# Altium schematic sheet 其他模块2.SchDoc
size A4
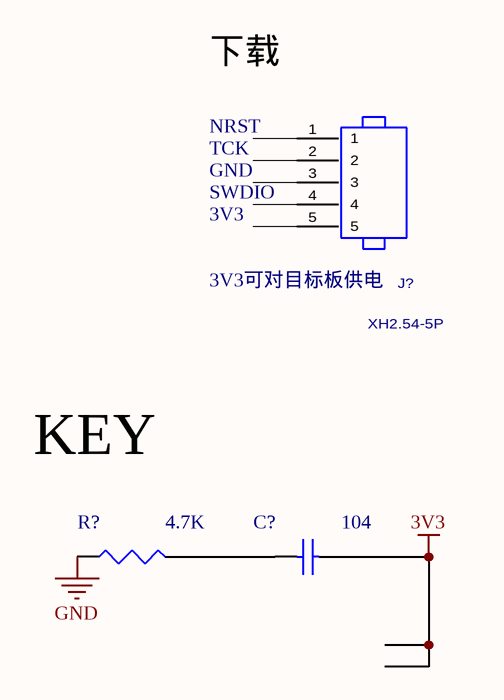
[diagram p0: 其他模块2.SchDoc]

## Parts
C?  value 104  [RAD-0.3]  (hidden comment: Cap)
J?  XH2.54-5P  [XH2.54-5P]
R?  value 4.7K  [J1-0603]  (hidden comment: Res3)

## Nets
3V3: C?.2
GND: R?.1
NetC?_1: C?.1 R?.2

Not connected (* = marked no-connect by the designer): J? 1 2 3 4 5

## Notes on the sheet
- NRST
- 下载
- TCK
- (near J?) SWDIO
- GND
- 3V3
- (near J?) 3V3可对目标板供电
- KEY

## Library data of the parts
C? = Cap: Capacitor; Published: 8-Jun-2000; LatestRevisionDate: 17-Jul-2002; LatestRevisionNote: Re-released for DXP Platform.; PackageReference: RAD-0.3; Publisher: Altium Limited; PackageDescription: Radial Cap, Thru-Hole; 2 Leads; 0.3 in Pin Spacing
R? = Res3: Resistor; Published: 8-Jun-2000; LatestRevisionDate: 29-May-2009; LatestRevisionNote: IPC-7351 Footprint Added.; PackageReference: J1-0603; Publisher: Altium Limited; PackageDescription: Chip Resistor
J? = XH2.54-5P: PCB DECAL: XH2.54-5P; Value: XH2.54-5P